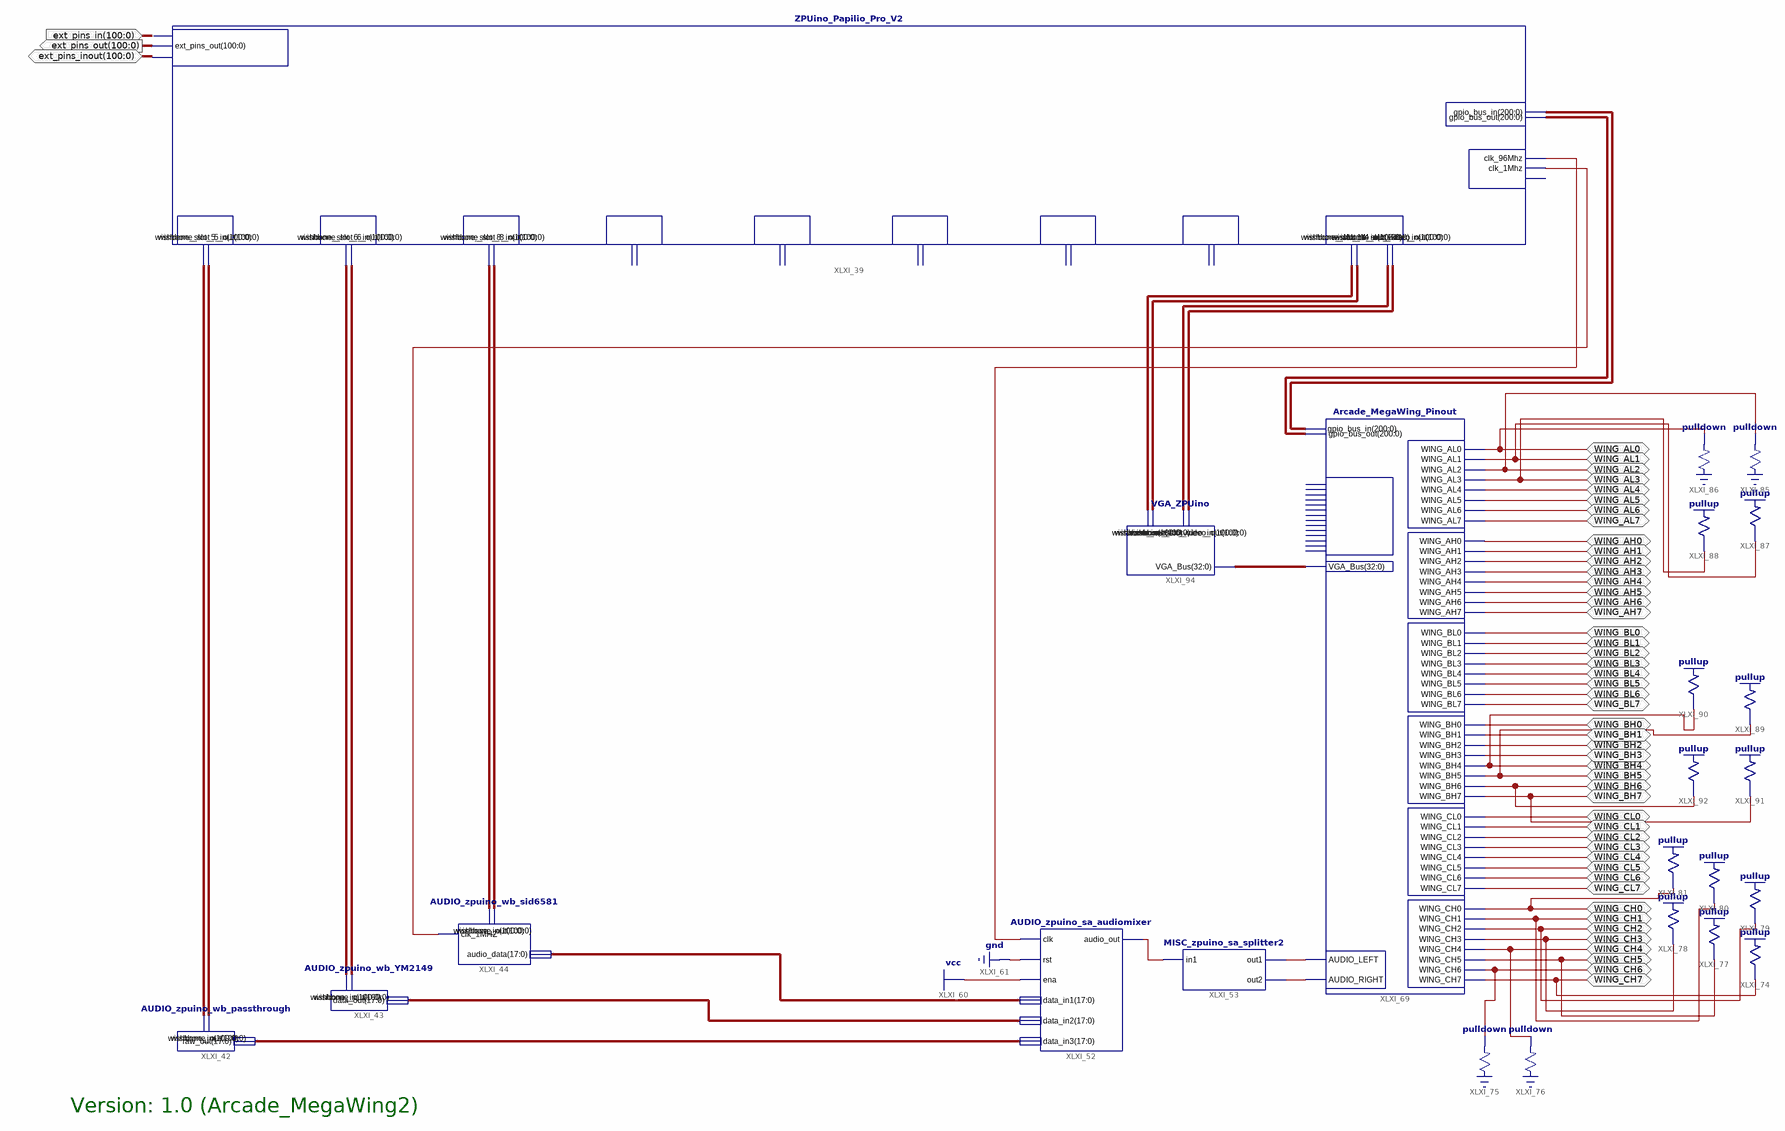
[diagram p0: schematic sheet 1]
// Xilinx ISE schematic Papilio_Pro.sch (spartan6) as structural Verilog: 24 symbols, 51 ports
module Papilio_Pro (
  input  [100:0] ext_pins_in,
  inout  WING_AL0,
  inout  WING_AL1,
  inout  WING_AL2,
  inout  WING_AL3,
  inout  WING_AL4,
  inout  WING_AL5,
  inout  WING_AL6,
  inout  WING_AL7,
  inout  WING_AH0,
  inout  WING_AH1,
  inout  WING_AH2,
  inout  WING_AH3,
  inout  WING_AH4,
  inout  WING_AH5,
  inout  WING_AH6,
  inout  WING_AH7,
  inout  WING_BL0,
  inout  WING_BL1,
  inout  WING_BL2,
  inout  WING_BL3,
  inout  WING_BL4,
  inout  WING_BL5,
  inout  WING_BL6,
  inout  WING_BL7,
  inout  WING_BH4,
  inout  WING_BH5,
  inout  WING_BH6,
  inout  WING_BH7,
  inout  WING_CL0,
  inout  WING_CL1,
  inout  WING_CL2,
  inout  WING_CL3,
  inout  WING_CL4,
  inout  WING_CL5,
  inout  WING_CL6,
  inout  WING_CL7,
  inout  WING_CH0,
  inout  WING_CH1,
  inout  WING_CH2,
  inout  WING_CH3,
  inout  WING_CH4,
  inout  WING_CH5,
  inout  WING_CH6,
  inout  WING_CH7,
  inout  [100:0] ext_pins_inout,
  inout  WING_BH0,
  inout  WING_BH1,
  inout  WING_BH2,
  inout  WING_BH3,
  output [100:0] ext_pins_out
);

  wire XLXN_456, XLXN_530, XLXN_531, XLXN_532, XLXN_533;
  wire [17:0] XLXN_467, XLXN_468, XLXN_469;
  wire [32:0] XLXN_554;
  wire [100:0] XLXN_450, XLXN_451, XLXN_452, XLXN_453, XLXN_454, XLXN_455, XLXN_555, XLXN_556, XLXN_557,
       XLXN_558;
  wire [200:0] XLXN_408, XLXN_549;

  ZPUino_Papilio_Pro_V2 XLXI_39 (
    .gpio_bus_out(XLXN_408), .gpio_bus_in(XLXN_549), .clk_96Mhz(XLXN_531), .clk_1Mhz(XLXN_530),
    .ext_pins_in(ext_pins_in), .ext_pins_out(ext_pins_out), .ext_pins_inout(ext_pins_inout),
    .wishbone_slot_5_out(XLXN_451), .wishbone_slot_5_in(XLXN_450), .wishbone_slot_6_in(XLXN_452),
    .wishbone_slot_6_out(XLXN_453), .wishbone_slot_8_in(XLXN_454), .wishbone_slot_8_out(XLXN_455),
    .wishbone_slot_14_in(XLXN_555), .wishbone_slot_14_out(XLXN_556), .wishbone_slot_video_in(XLXN_557),
    .wishbone_slot_video_out(XLXN_558));  // open: clk_osc_32Mhz, wishbone_slot_9_in, wishbone_slot_9_out, wishbone_slot_10_in, wishbone_slot_10_out, wishbone_slot_11_in, wishbone_slot_11_out, wishbone_slot_12_in, wishbone_slot_12_out, wishbone_slot_13_in, wishbone_slot_13_out
  MISC_zpuino_sa_splitter2 XLXI_53 (.in1(XLXN_456), .out1(XLXN_532), .out2(XLXN_533));
  AUDIO_zpuino_sa_audiomixer XLXI_52 (
    .clk(XLXN_531), .rst(1'b0), .ena(1'b1), .data_in1(XLXN_469), .data_in2(XLXN_468), .data_in3(XLXN_467),
    .audio_out(XLXN_456));
  AUDIO_zpuino_wb_sid6581 XLXI_44 (
    .clk_1MHZ(XLXN_530), .audio_data(XLXN_469), .wishbone_in(XLXN_454), .wishbone_out(XLXN_455));
  AUDIO_zpuino_wb_YM2149 XLXI_43 (.data_out(XLXN_468), .wishbone_in(XLXN_452), .wishbone_out(XLXN_453));
  AUDIO_zpuino_wb_passthrough XLXI_42 (.raw_out(XLXN_467), .wishbone_in(XLXN_450), .wishbone_out(XLXN_451));
  Arcade_MegaWing_Pinout XLXI_69 (
    .gpio_bus_out(XLXN_408), .gpio_bus_in(XLXN_549), .WING_AL0(WING_AL0), .WING_AL1(WING_AL1),
    .WING_AL2(WING_AL2), .WING_AL3(WING_AL3), .WING_AL4(WING_AL4), .WING_AL5(WING_AL5), .WING_AL6(WING_AL6),
    .WING_AL7(WING_AL7), .WING_AH0(WING_AH0), .WING_AH1(WING_AH1), .WING_AH2(WING_AH2), .WING_AH3(WING_AH3),
    .WING_AH4(WING_AH4), .WING_AH5(WING_AH5), .WING_AH6(WING_AH6), .WING_AH7(WING_AH7), .WING_BL0(WING_BL0),
    .WING_BL1(WING_BL1), .WING_BL2(WING_BL2), .WING_BL3(WING_BL3), .WING_BL4(WING_BL4), .WING_BL5(WING_BL5),
    .WING_BL6(WING_BL6), .WING_BL7(WING_BL7), .WING_BH0(WING_BH0), .WING_BH1(WING_BH1), .WING_BH2(WING_BH2),
    .WING_BH3(WING_BH3), .WING_BH4(WING_BH4), .WING_BH5(WING_BH5), .WING_BH6(WING_BH6), .WING_BH7(WING_BH7),
    .WING_CL0(WING_CL0), .WING_CL1(WING_CL1), .WING_CL2(WING_CL2), .WING_CL3(WING_CL3), .WING_CL4(WING_CL4),
    .WING_CL5(WING_CL5), .WING_CL6(WING_CL6), .WING_CL7(WING_CL7), .WING_CH0(WING_CH0), .WING_CH1(WING_CH1),
    .WING_CH2(WING_CH2), .WING_CH3(WING_CH3), .WING_CH4(WING_CH4), .WING_CH5(WING_CH5), .WING_CH6(WING_CH6),
    .WING_CH7(WING_CH7), .AUDIO_LEFT(XLXN_532), .AUDIO_RIGHT(XLXN_533), .VGA_Bus(XLXN_554));  // open: VGA_Red2, VGA_Red1, VGA_Red0, VGA_Green2, VGA_Green1, VGA_Green0, VGA_Hsync, VGA_Vsync, VGA_Red3, VGA_Green3, VGA_Blue3, VGA_Blue1, VGA_Blue0, VGA_Blue2
  \pullup  XLXI_74 (.O(WING_CH7));
  \pulldown  XLXI_75 (.O(WING_CH6));
  \pulldown  XLXI_76 (.O(WING_CH4));
  \pullup  XLXI_77 (.O(WING_CH5));
  \pullup  XLXI_78 (.O(WING_CH3));
  \pullup  XLXI_79 (.O(WING_CH2));
  \pullup  XLXI_80 (.O(WING_CH1));
  \pullup  XLXI_81 (.O(WING_CH0));
  \pulldown  XLXI_85 (.O(WING_AL2));
  \pulldown  XLXI_86 (.O(WING_AL0));
  \pullup  XLXI_87 (.O(WING_AL1));
  \pullup  XLXI_88 (.O(WING_AL3));
  \pullup  XLXI_89 (.O(WING_BH5));
  \pullup  XLXI_90 (.O(WING_BH4));
  \pullup  XLXI_91 (.O(WING_BH7));
  \pullup  XLXI_92 (.O(WING_BH6));
  VGA_ZPUino XLXI_94 (
    .wishbone_in(XLXN_555), .wishbone_out(XLXN_556), .wishbone_slot_video_in(XLXN_557),
    .wishbone_slot_video_out(XLXN_558), .VGA_Bus(XLXN_554));

  // Notes on the sheet:
  //   Version: 1.0 (Arcade_MegaWing2)
endmodule
